# Altium schematic sheet Stabilizator.SchDoc
size A4
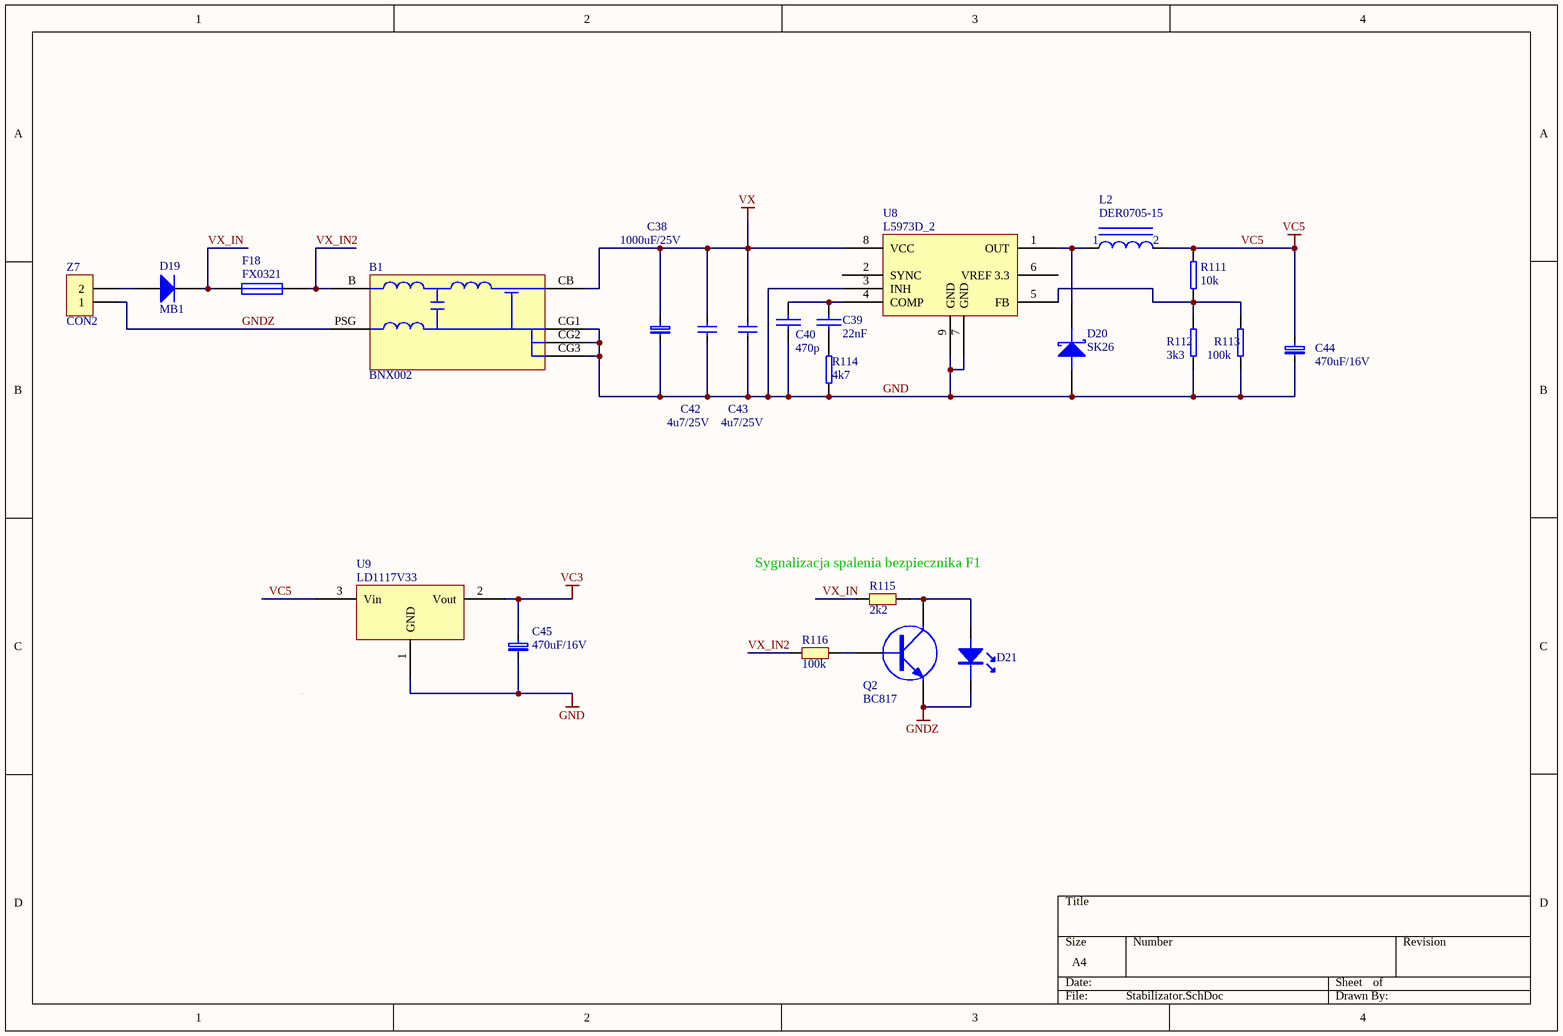
[diagram p0: Stabilizator.SchDoc]

## Parts
B1  BNX002  [BNX002]
C38  1000uF/25V  [RB-.2/.4]
C39  22nF  [0603C]
C40  470p  [0603C]
C42  4u7/25V  [1206]
C43  4u7/25V  [1206]
C44  470uF/16V  [CAP_D]
C45  470uF/16V  [CAP_D]
D19  MB1  [RD5]
D20  SK26  [RD5]
D21  LED1  [0805LR]  (value not drawn)
F18  FX0321  [FX300]
L2  DER0705-15  [DER0705_1]
Q2  BC817  [SOT23-3Q]
R111  10k  [0603R]
R112  3k3  [0603R]
R113  100k  [0603R]
R114  4k7  [0603R]
R115  2k2  [0603R]
R116  100k  [0603R]
U8  L5973D_2  [SO8_M]
U9  LD1117V33  [DPAK]
Z7  CON2  [ARC-2-5.08-A1]

## Nets
GND: B1.CG1 B1.CG2 B1.CG3 C38.1 C40.2 C42.1 C43.1 C44.1 C45.1 D20.A R112.2 R113.2 R114.2 U8.3(INH) U8.7(GND) U8.9(GND) U9.1(GND)
GNDZ: B1.PSG D21.K Q2.E Z7.1
VC3: C45.2 U9.2(Vout)
VC5: C44.2 L2.2 R111.1 U9.3(Vin)
VX: B1.CB C38.2 C42.2 C43.2 U8.8(VCC)
VX_IN: D19.K F18.1 R115.2
VX_IN2: B1.B F18.2 R116.2
NetC39_1: C39.1 R114.1
NetC39_2: C39.2 C40.1 U8.4(COMP)
NetD19_A: D19.A Z7.2
NetD20_K: D20.K L2.1 U8.1(OUT)
NetD21_A: D21.A Q2.C R115.1
NetQ2_B: Q2.B R116.1
NetR111_2: R111.2 R112.1 R113.1 U8.5(FB)

Not connected (* = marked no-connect by the designer): U8 2(SYNC) 6(VREF_3.3)

## Notes on the sheet
- (near R115) Sygnalizacja spalenia bezpiecznika F1

## Library data of the parts
C38 C44 C45 = CAP_TANTAL_SMD: KONDENSATOR ELEKTROLITYCZNY TANTALOWY SMD
C39 C40 = CAP: Capacitor
C42 C43 = CAP
D19 = Diode: Default Diode; Published: 8-Jun-2000; LatestRevisionDate: 17-Jul-2002; LatestRevisionNote: Re-released for DXP Platform.; PackageVersion: Sep-1996; PackageReference: SMC; Publisher: Altium Limited; PackageDescription: DO-214-AB/SMC; 2 C-Bend Leads; Body 7.9 x 5.9 mm, inc. leads (LxW); Code_JEDEC: DO-214-AB
D20 = DIODE SCHOTTKY: Schottky Diode
F18 = FUSE1: Fuse
L2 = CEWKA_1
Q2 = NPN-SOT23: NPN Transistor
R111-R116 = RES3
Z7 = CON2: Connector